# EAGLE design alarm (EAGLE 9.6.1)
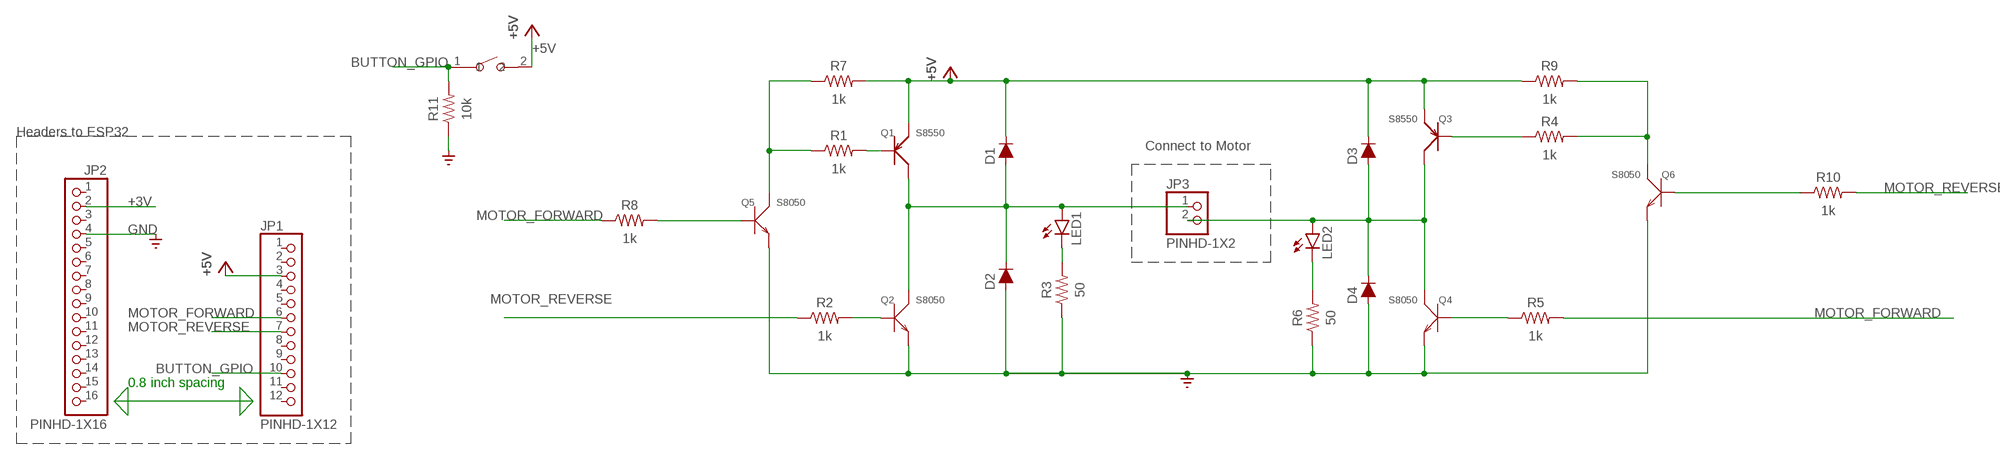
[diagram p0: schematic, sheet 1]

## Parts
D1  250mA/100V  DIODE-BAS16J  [SOD-323]
D2  250mA/100V  DIODE-BAS16J  [SOD-323]
D3  250mA/100V  DIODE-BAS16J  [SOD-323]
D4  250mA/100V  DIODE-BAS16J  [SOD-323]
JP1  PINHD-1X12  [1X12]
JP2  PINHD-1X16  [1X16]
JP3  PINHD-1X2  [1X02]
LED1  LED-GREEN0603  [0603-GREEN]
LED2  LED-ORANGE0603  [0603-ORANGE]
Q1  S8550  SMD-TRANSISTORS-PNP-25V-500MA-S8550(SOT-23)  [SOT-23]
Q2  S8050  SMD-TRANSISTORS-NPN-25V-500MW-S8050(SOT-23)  [SOT-23]
Q3  S8550  SMD-TRANSISTORS-PNP-25V-500MA-S8550(SOT-23)  [SOT-23]
Q4  S8050  SMD-TRANSISTORS-NPN-25V-500MW-S8050(SOT-23)  [SOT-23]
Q5  S8050  SMD-TRANSISTORS-NPN-25V-500MW-S8050(SOT-23)  [SOT-23]
Q6  S8050  SMD-TRANSISTORS-NPN-25V-500MW-S8050(SOT-23)  [SOT-23]
R1  1k  R-US_CHIP-0603(1608-METRIC)  [RESC1608X60]
R2  1k  R-US_CHIP-0603(1608-METRIC)  [RESC1608X60]
R3  50  R-US_CHIP-0603(1608-METRIC)  [RESC1608X60]
R4  1k  R-US_CHIP-0603(1608-METRIC)  [RESC1608X60]
R5  1k  R-US_CHIP-0603(1608-METRIC)  [RESC1608X60]
R6  50  R-US_CHIP-0603(1608-METRIC)  [RESC1608X60]
R7  1k  R-US_CHIP-0603(1608-METRIC)  [RESC1608X60]
R8  1k  R-US_CHIP-0603(1608-METRIC)  [RESC1608X60]
R9  1k  R-US_CHIP-0603(1608-METRIC)  [RESC1608X60]
R10  1k  R-US_CHIP-0603(1608-METRIC)  [RESC1608X60]
R11  10k  R-US_CHIP-0603(1608-METRIC)  [RESC1608X60]
SW1  B3U-1000P-2P-SMD  SMD-BUTTON(2P-3.0X2.5X1.2+0.4MM)-B3U-1000P-2P-SMD  [SW2-2.6-3.0X2.5X1.2+0.4MM]

## Nets
+3V: JP2.2
+5V: D1.C D3.C JP1.3 Q1.2(E) Q3.2(E) R7.2 R9.1 SW1.2
BUTTON_GPIO: JP1.10 R11.2 SW1.1
GND: D2.A D4.A JP2.4 Q2.2(E) Q4.2(E) Q5.2(E) Q6.2(E) R3.1 R6.1 R11.1 ; supply symbol labelled SUPPLY0_GND_
MOTOR_BLACK: D3.A D4.C JP3.2 LED2.A Q3.3(C) Q4.3(C)
MOTOR_FORWARD: JP1.6 R5.2 R8.1
MOTOR_RED: D1.A D2.C JP3.1 LED1.A Q1.3(C) Q2.3(C)
MOTOR_REVERSE: JP1.7 R2.1 R10.2
N$1: Q1.1(B) R1.2
N$2: Q2.1(B) R2.2
N$4: LED1.C R3.2
N$5: Q5.1(B) R8.2
N$11: Q3.1(B) R4.1
N$12: Q4.1(B) R5.1
N$13: LED2.C R6.2
N$14: Q5.3(C) R1.1 R7.1
N$15: Q6.3(C) R4.2 R9.2
N$17: Q6.1(B) R10.1
Unconnected: JP1.1 JP1.2 JP1.4 JP1.5 JP1.8 JP1.9 JP1.11 JP1.12 JP2.1 JP2.3 JP2.5 JP2.6 JP2.7 JP2.8 JP2.9 JP2.10 JP2.11 JP2.12 JP2.13 JP2.14 JP2.15 JP2.16

## Notes on the sheet
- Headers to ESP32
- Connect to Motor
- 0.8 inch spacing

## Library data of the parts
D1-D4 = SparkFun-DiscreteSemi:DIODE: Diode These are standard reverse protection diodes and small signal diodes. SparkFun Products: SparkFun SparkPunk Sound Kit <https://www.sparkfun.com/products/11177> SparkFun ESP8266 Thing <https://www.sparkfun.com/products/13231>; PROD_ID: DIO-09646
JP1 = Connector:PINHD-1X12: PIN HEADER; CATEGORY: CONNECTOR; SUB-CATEGORY: PIN-HEADER
JP2 = Connector:PINHD-1X16: PIN HEADER; CATEGORY: CONNECTOR; SUB-CATEGORY: PIN-HEADER
JP3 = Connector:PINHD-1X2: PIN HEADER; CATEGORY: CONNECTOR; SUB-CATEGORY: PIN-HEADER
LED1 = BeagleBone_Blue_R3:LED-GREEN
LED2 = BeagleBone_Blue_R3:LED-ORANGE
Q1 Q3 = OPL_Discrete_Semiconductor:SMD-TRANSISTORS-PNP-25V-500MA-S8550(SOT-23): 305020006; MPN: S8550
Q2 Q4-Q6 = OPL_Discrete_Semiconductor:SMD-TRANSISTORS-NPN-25V-500MW-S8050(SOT-23): 305010017; MPN: S8050
R1-R11 = Resistor:R-US: Resistor Fixed - ANSI; CATEGORY: Resistor; SUB-CATEGORY: Fixed
SW1 = OPL_Switch:SMD-BUTTON(2P-3.0X2.5X1.2+0.4MM): 311020047; MPN: B3U-1000P-2P-SMD

## Board
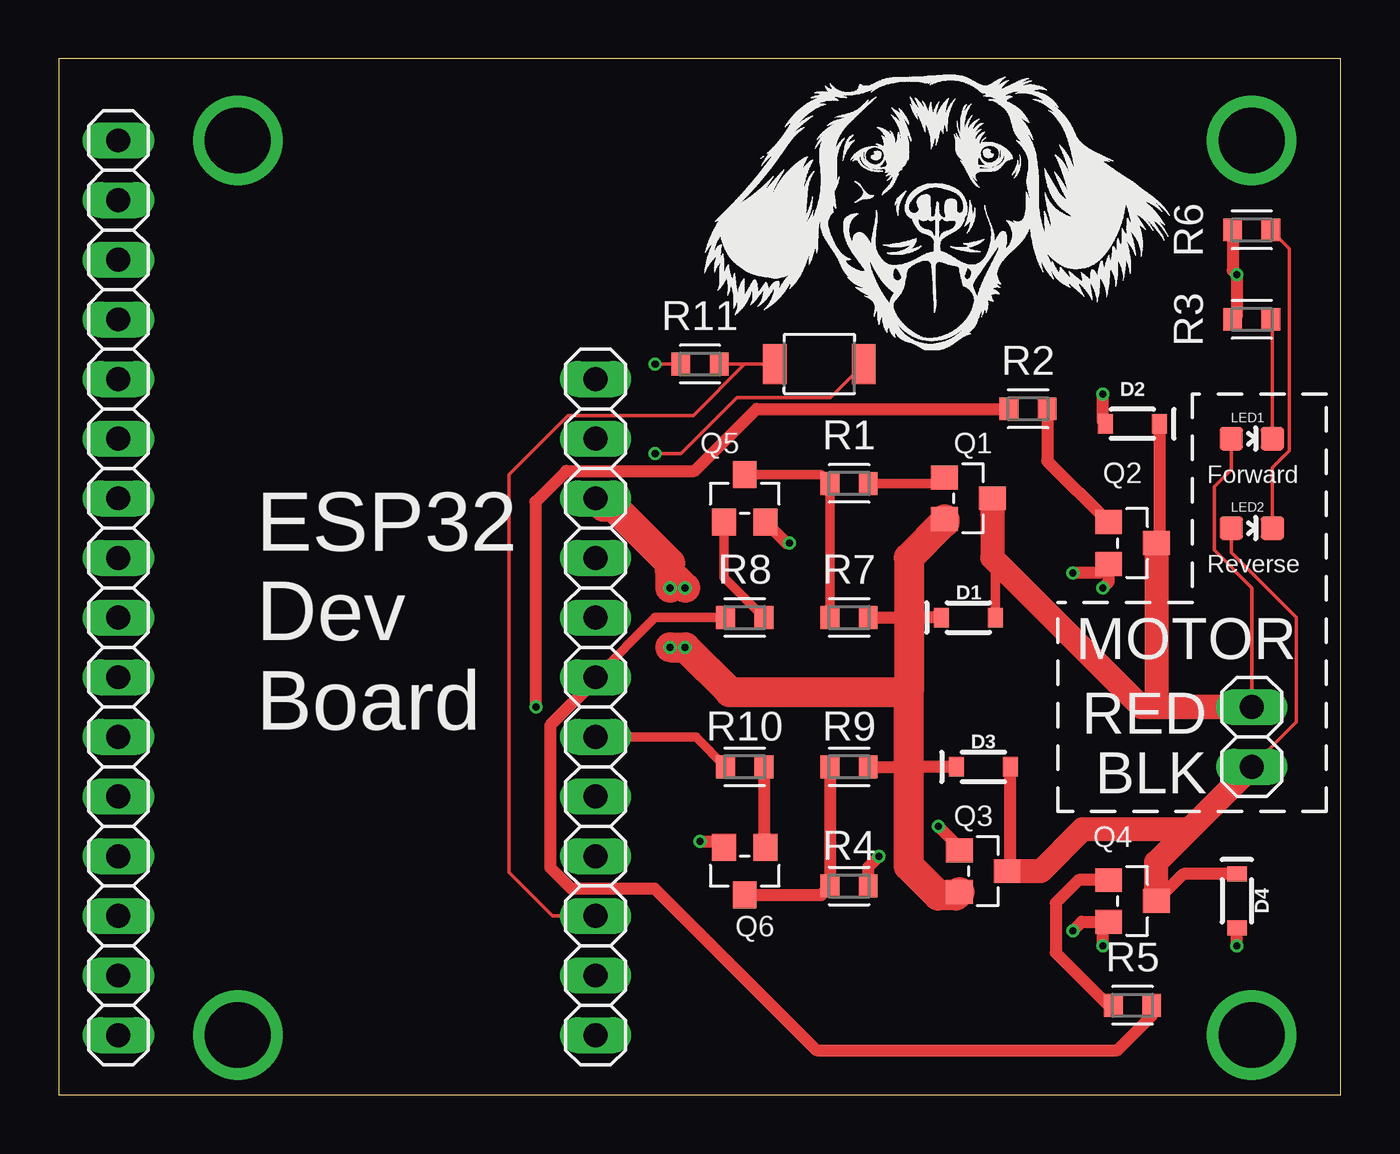
[diagram p1: board, top side]
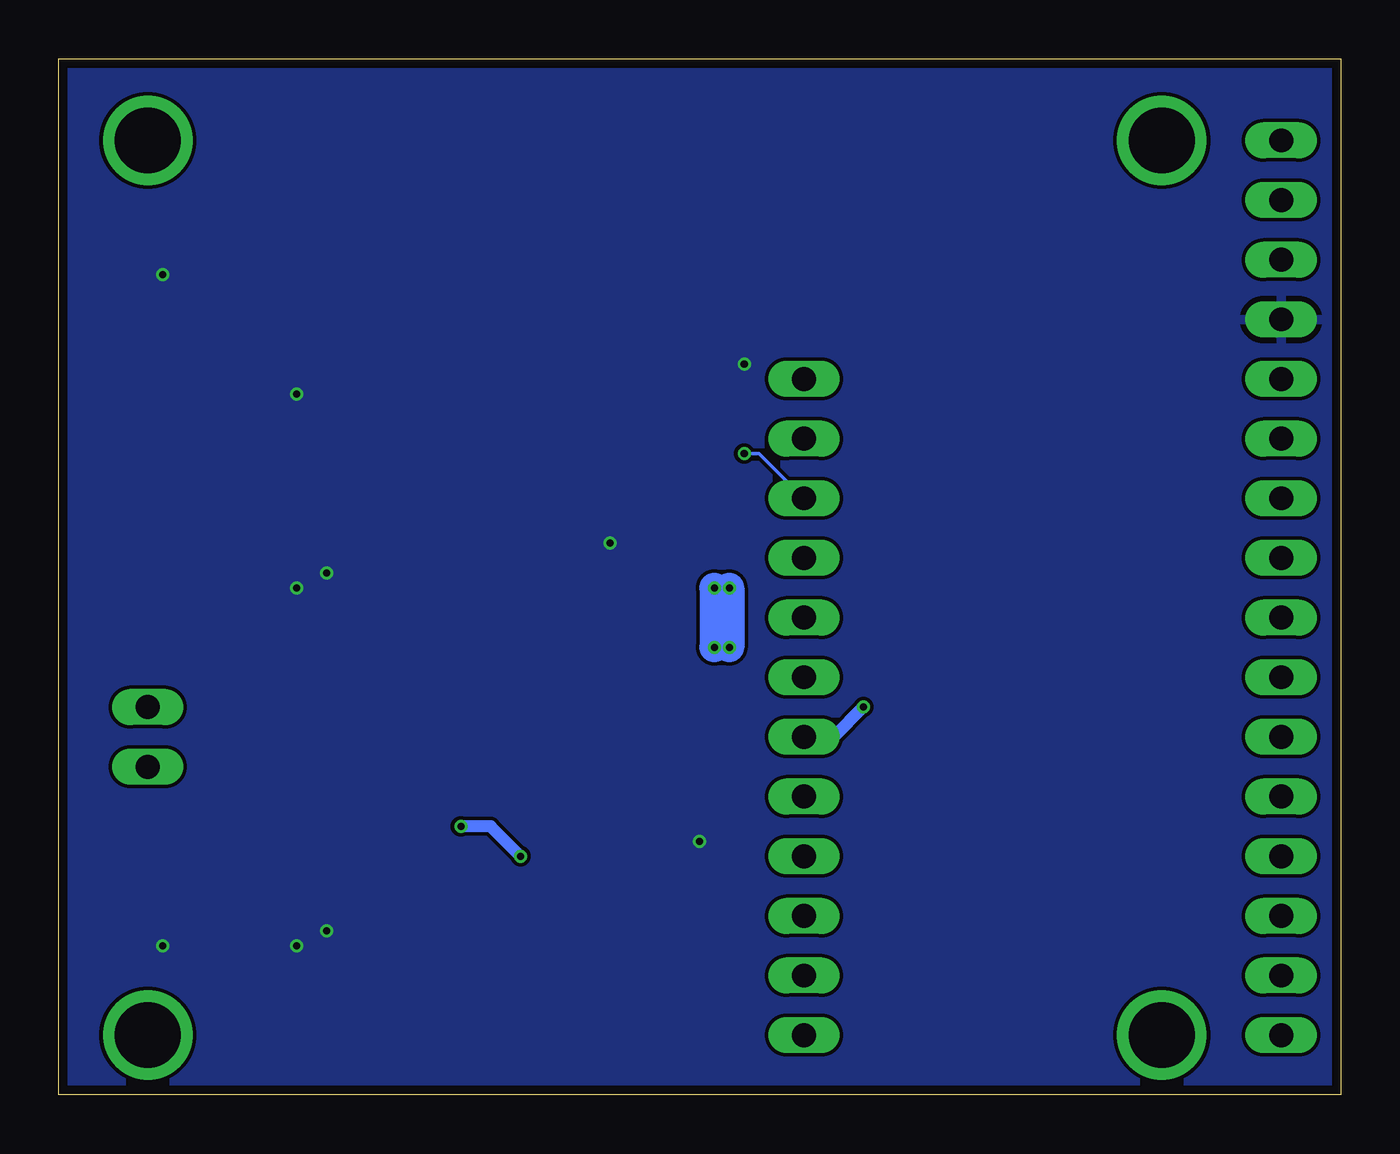
[diagram p2: board, bottom side, seen from below]

Size 54.59 x 44.12 mm. Coordinates in mm from the lower left corner, seen from the top.
Outline: 0,0 54.59,0 54.59,44.12 0,44.12 0,0
Copper layers (1*16): Top 0.035559375mm / dielectric 1.6mm / Bottom 0.035559375mm
Design rules "osh_park_2_layer": minimum track width 6mil, minimum drill 10mil, track to track 6mil, track to pad 6mil, pad to pad 6mil, via to via 6mil, smd to smd 6mil, copper to edge 15mil, drill to drill 6mil, minimum pad ring 5mil, minimum via ring 5mil, stop-mask expansion 2.5mil, vias tented up to drill 0mil, thermal gap 10mil

### Footprints (pad centres in the part's own frame; a part is rotated, then mirrored left to right if it is on the bottom)
SOD-323 = smd 0.63 x 0.83: A 1.15,0; C -1.15,0
1X12 = drill 1.016 long: 1 -13.97,0; 2 -11.43,0; 3 -8.89,0; 4 -6.35,0; 5 -3.81,0; 6 -1.27,0; 7 1.27,0; 8 3.81,0; 9 6.35,0; 10 8.89,0; 11 11.43,0; 12 13.97,0
1X16 = drill 1.016 long: 1 -19.05,0; 2 -16.51,0; 3 -13.97,0; 4 -11.43,0; 5 -8.89,0; 6 -6.35,0; 7 -3.81,0; 8 -1.27,0; 9 1.27,0; 10 3.81,0; 11 6.35,0; 12 8.89,0; 13 11.43,0; 14 13.97,0; 15 16.51,0; 16 19.05,0
1X02 = drill 1.016 long: 1 -1.27,0; 2 1.27,0
0603-GREEN = smd 1 x 1: A 0,-0.877; C 0,0.877
0603-ORANGE = smd 1 x 1: A 0,-0.877; C 0,0.877
SOT-23 = smd 1.016 x 1.143: 1 -0.889,-1.016; 2 0.889,-1.016; 3 0,1.016
RESC1608X60 = smd 0.799 x 0.974: 1 -0.815,0; 2 0.815,0
SW2-2.6-3.0X2.5X1.2+0.4MM = smd 1 x 1.7: 1 -1.9,0; 2 1.9,0

### Placement (x,y rotation side)
D1  38.73,20.32 0 top
D2  45.72,28.57 180 top
D3  39.37,13.97 0 top
D4  50.16,8.26 270 top
JP1  22.86,16.51 270 top
JP2  2.54,21.59 270 top
JP3  50.8,15.24 270 top
LED1  50.8,27.94 270 top
LED2  50.8,24.13 270 top
Q1  38.73,25.4 270 top
Q2  45.72,23.5 270 top
Q3  39.37,9.53 270 top
Q4  45.72,8.26 270 top
Q5  29.21,25.4 0 top
Q6  29.21,9.53 180 top
R1  33.66,26.04 0 top
R2  41.27,29.21 0 top
R3  50.8,33.02 0 top
R4  33.66,8.89 180 top
R5  45.72,3.81 0 top
R6  50.8,36.83 0 top
R7  33.66,20.32 0 top
R8  29.21,20.32 0 top
R9  33.66,13.97 180 top
R10  29.21,13.97 180 top
R11  27.3,31.11 0 top
SW1  32.38,31.11 0 top

### Tracks (layer width: path | path; a pad name or v marks a point on that pad's centre or on a via)
+5V  (via drill 0.3)
  Top 0.152: v25.4,27.3 26.49,27.3 28.88,29.69 32.86,29.69 SW1.2
  Top 0.508: D1.C 36.2,20.32 R7.2 | R9.1 36.2,13.97 D3.C
  Top 1.27: JP1.3 23.22,25.04 23.63,25.04 26.04,22.64 26.04,22.23 | 26.04,22.23 v26.04,21.59 | v26.67,21.59 26.04,22.23 | v26.04,19.05 v26.67,19.05 28.57,17.14 36.2,17.14 | Q3.2 38.2,8.48 37.46,8.48 36.2,9.74 36.2,13.97 36.2,17.14 | Q1.2 37.72,24.38 36.2,22.86 36.2,20.32 36.2,17.14
  Bottom 0.152: JP1.3 24.77,27.3 v25.4,27.3
  Bottom 1.27: v26.04,21.59 v26.04,19.05 | v26.67,21.59 v26.67,19.05
BUTTON_GPIO
  Top 0.152: SW1.1 29.21,31.11 | 29.21,31.11 R11.2 | JP1.10 21.03,7.62 19.18,9.48 19.18,26.42 21.69,28.93 27.03,28.93 29.21,31.11
GND  (via drill 0.3)
  Top 0.152: R11.1 v25.4,31.11
  Top 0.508: v50.16,6.35 D4.A | v44.45,6.35 44.45,7.11 Q4.2 43.56,7.37 v43.18,6.99 | v44.45,21.59 44.7,21.84 Q2.2 44.32,22.23 v43.18,22.23 | D2.A 44.45,28.7 v44.45,29.84 | R3.1 50.16,33.2 v50.16,34.92 49.98,35.1 R6.1 | Q5.2 30.99,23.5 v31.11,23.5 | v27.3,10.79 28.07,10.79 Q6.2
  pour Bottom: 0,45.72 65.41,45.72 65.41,0 0,0
MOTOR_BLACK
  Top 0.152: LED2.A 49.92,23.1 52.7,20.32 52.7,15.88 JP3.2
  Top 0.508: Q3.3 40.52,9.66 D3.A | D4.C 47.89,9.4 Q4.3
  Top 1.016: Q3.3 41.81,9.53 43.6,11.31 48.14,11.31 JP3.2 46.74,9.91 Q4.3
MOTOR_FORWARD
  Top 0.406: JP1.6 25.4,20.32 R8.1
  Top 0.508: JP1.6 22.86,17.65 20.93,15.72 20.93,9.68 21.82,8.79 25.38,8.79 32.26,1.91 45.09,1.91 46.53,3.35 R5.2
MOTOR_RED
  Top 0.152: LED1.A 49.92,26.64 49.19,25.91 49.19,23.2 50.8,21.59 JP3.1
  Top 0.406: 39.75,24.77 39.88,24.63 D1.A
  Top 0.508: D2.C 46.87,23.63 Q2.3
  Top 1.016: Q1.3 39.75,24.77 39.75,22.86 46.1,16.51 JP3.1 46.74,16.51 Q2.3
MOTOR_REVERSE  (via drill 0.3)
  Top 0.406: JP1.7 27.12,15.24 R10.2
  Top 0.508: R2.1 29.71,29.21 27.07,26.57 21.61,26.57 20.3,25.25 20.3,16.54 v20.32,16.51
  Bottom 0.508: JP1.7 21.59,15.24 v20.32,16.51
N$1
  Top 0.406: R1.2 37.47,26.04 Q1.1
N$2
  Top 0.508: R2.2 42.09,27 Q2.1
N$4
  Top 0.152: LED1.C 51.68,32.96 R3.2
N$5
  Top 0.406: R8.2 28.32,22.02 Q5.1
N$7  (via drill 2.79)
  other vias: 7.62,40.64
N$8  (via drill 2.79)
  other vias: 7.62,2.54
N$9  (via drill 2.79)
  other vias: 50.8,2.54
N$11  (via drill 0.3)
  Top 0.508: R4.1 34.47,9.71 v34.92,10.16 | v37.47,11.43 38.35,10.54 Q3.1
  Bottom 0.508: v34.92,10.16 36.2,11.43 v37.47,11.43
N$12
  Top 0.508: R5.1 44.7,3.81 42.46,6.05 42.46,8.17 43.43,9.14 Q4.1
N$13
  Top 0.152: LED2.C 51.68,26.7 52.41,27.43 52.41,36.04 R6.2
N$14
  Top 0.406: Q5.3 32.46,26.42 R1.1 R7.1
N$15
  Top 0.508: Q6.3 32.46,8.51 R4.2 R9.2
N$16  (via drill 2.79)
  other vias: 50.8,40.64
N$17
  Top 0.508: R10.1 30.02,10.62 Q6.1

### Text on the board
tPlace: Forward | Reverse | MOTOR | RED | ESP32 / Dev / Board | BLK
tValues: Puppy Alarm Clock PCB / Designed by Henry Gilbert / January 2021